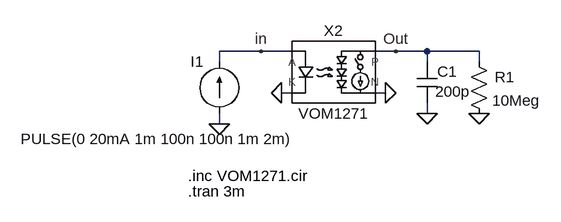
[diagram p0: schematic VOM1271_TRAN.asc]
VOM1271_TRAN.asc, the LTspice schematic file:
Version 4
SHEET 1 880 680
WIRE 128 112 64 112
WIRE 176 112 128 112
WIRE 336 112 304 112
WIRE 384 112 336 112
WIRE 464 112 384 112
WIRE 64 128 64 112
WIRE 384 128 384 112
WIRE 464 128 464 112
WIRE 176 176 160 176
WIRE 320 176 304 176
WIRE 384 208 384 192
WIRE 64 224 64 208
FLAG 64 224 0
FLAG 160 176 0
FLAG 128 112 in
FLAG 320 176 0
FLAG 336 112 Out
FLAG 384 208 0
FLAG 464 208 0
SYMBOL current 64 208 R180
WINDOW 0 24 80 Left 2
WINDOW 3 -115 -39 Left 2
WINDOW 123 0 0 Left 2
WINDOW 39 0 0 Left 2
SYMATTR InstName I1
SYMATTR Value PULSE(0 20mA 1m 100n 100n 1m 2m)
SYMBOL vom1271 240 144 R0
SYMATTR InstName X2
SYMBOL cap 368 128 R0
WINDOW 3 29 46 Left 2
WINDOW 39 36 61 Left 2
WINDOW 0 32 15 Left 2
SYMATTR Value 200p
SYMATTR InstName C1
SYMBOL res 448 112 R0
WINDOW 0 40 40 Left 2
SYMATTR InstName R1
SYMATTR Value 10Meg
TEXT 16 328 Left 2 !.tran 3m
TEXT 16 304 Left 2 !.inc VOM1271.cir

The netlist it stands for:
* VOM1271_TRAN.asc
I1 0 in PULSE(0 20mA 1m 100n 100n 1m 2m)
XX2 in 0 Out 0 VOM1271 VOM1271  ; pins A K P N
C1 Out 0 200p
R1 Out 0 10Meg
.tran 3m
.inc VOM1271.cir
.lib VOM1271.cir
.backanno
.end